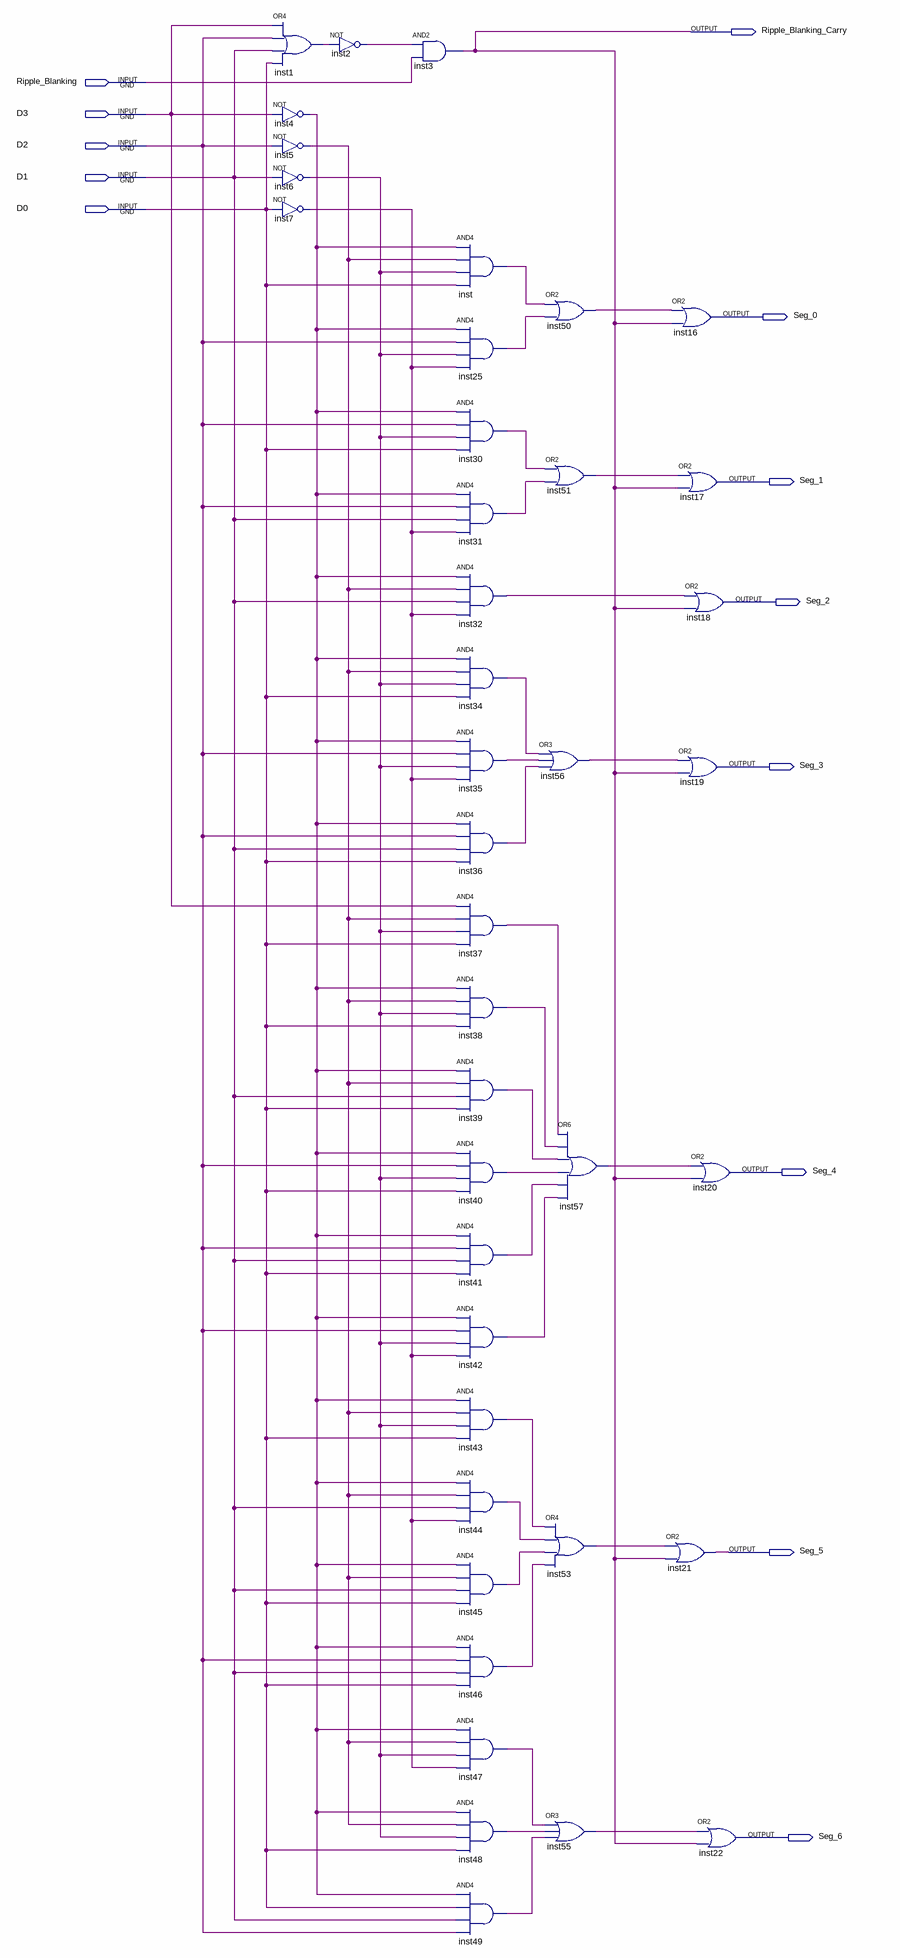
[diagram p0: schematic sheet]
// Quartus schematic 7_seg_driver.bdf as structural Verilog: 41 symbols, 13 pins
module \7_seg_driver  (
  input  Ripple_Blanking,
  input  D3,
  input  D2,
  input  D1,
  input  D0,
  output Ripple_Blanking_Carry,
  output Seg_0,
  output Seg_1,
  output Seg_2,
  output Seg_3,
  output Seg_4,
  output Seg_5,
  output Seg_6
);

  wire inst1_out, inst2_out, inst4_out, inst5_out, inst6_out, inst7_out, inst25_out, inst30_out, inst31_out,
       inst32_out, inst34_out, inst35_out, inst36_out, inst37_out, inst38_out, inst39_out, inst40_out,
       inst41_out, inst42_out, inst43_out, inst44_out, inst45_out, inst46_out, inst47_out, inst48_out,
       inst49_out, inst50_out, inst51_out, inst53_out, inst55_out, inst56_out, inst57_out, inst_out;

  or inst1 (inst1_out, D3, D2, D1, D0);
  not inst4 (inst4_out, D3);
  not inst5 (inst5_out, D2);
  not inst6 (inst6_out, D1);
  not inst7 (inst7_out, D0);
  not inst2 (inst2_out, inst1_out);
  and inst3 (Ripple_Blanking_Carry, inst2_out, Ripple_Blanking);
  and inst (inst_out, inst4_out, inst5_out, inst6_out, D0);
  and inst25 (inst25_out, inst4_out, D2, inst6_out, inst7_out);
  and inst30 (inst30_out, inst4_out, D2, inst6_out, D0);
  and inst31 (inst31_out, inst4_out, D2, D1, inst7_out);
  and inst32 (inst32_out, inst4_out, inst5_out, D1, inst7_out);
  and inst34 (inst34_out, inst4_out, inst5_out, inst6_out, D0);
  and inst35 (inst35_out, inst4_out, D2, inst6_out, inst7_out);
  and inst36 (inst36_out, inst4_out, D2, D1, D0);
  and inst37 (inst37_out, D3, inst5_out, inst6_out, D0);
  and inst38 (inst38_out, inst4_out, inst5_out, inst6_out, D0);
  and inst39 (inst39_out, inst4_out, inst5_out, D1, D0);
  and inst40 (inst40_out, inst4_out, D2, inst6_out, D0);
  and inst41 (inst41_out, inst4_out, D2, D1, D0);
  and inst42 (inst42_out, inst4_out, D2, inst6_out, inst7_out);
  and inst43 (inst43_out, inst4_out, inst5_out, inst6_out, D0);
  and inst44 (inst44_out, inst4_out, inst5_out, D1, inst7_out);
  and inst45 (inst45_out, inst4_out, inst5_out, D1, D0);
  and inst46 (inst46_out, inst4_out, D2, D1, D0);
  and inst47 (inst47_out, inst4_out, inst5_out, inst6_out, inst7_out);
  and inst48 (inst48_out, inst4_out, inst5_out, inst6_out, D0);
  and inst49 (inst49_out, inst4_out, D0, D1, D2);
  or inst50 (inst50_out, inst_out, inst25_out);
  or inst51 (inst51_out, inst30_out, inst31_out);
  or inst56 (inst56_out, inst34_out, inst35_out, inst36_out);
  or inst57 (inst57_out, inst37_out, inst38_out, inst39_out, inst40_out, inst41_out, inst42_out);
  or inst53 (inst53_out, inst43_out, inst44_out, inst45_out, inst46_out);
  or inst55 (inst55_out, inst47_out, inst48_out, inst49_out);
  or inst21 (Seg_5, inst53_out, Ripple_Blanking_Carry);
  or inst16 (Seg_0, inst50_out, Ripple_Blanking_Carry);
  or inst17 (Seg_1, inst51_out, Ripple_Blanking_Carry);
  or inst18 (Seg_2, inst32_out, Ripple_Blanking_Carry);
  or inst19 (Seg_3, inst56_out, Ripple_Blanking_Carry);
  or inst20 (Seg_4, inst57_out, Ripple_Blanking_Carry);
  or inst22 (Seg_6, inst55_out, Ripple_Blanking_Carry);
endmodule
